# Altium schematic sheet M3_Discrete_Interface.SchDoc
size A
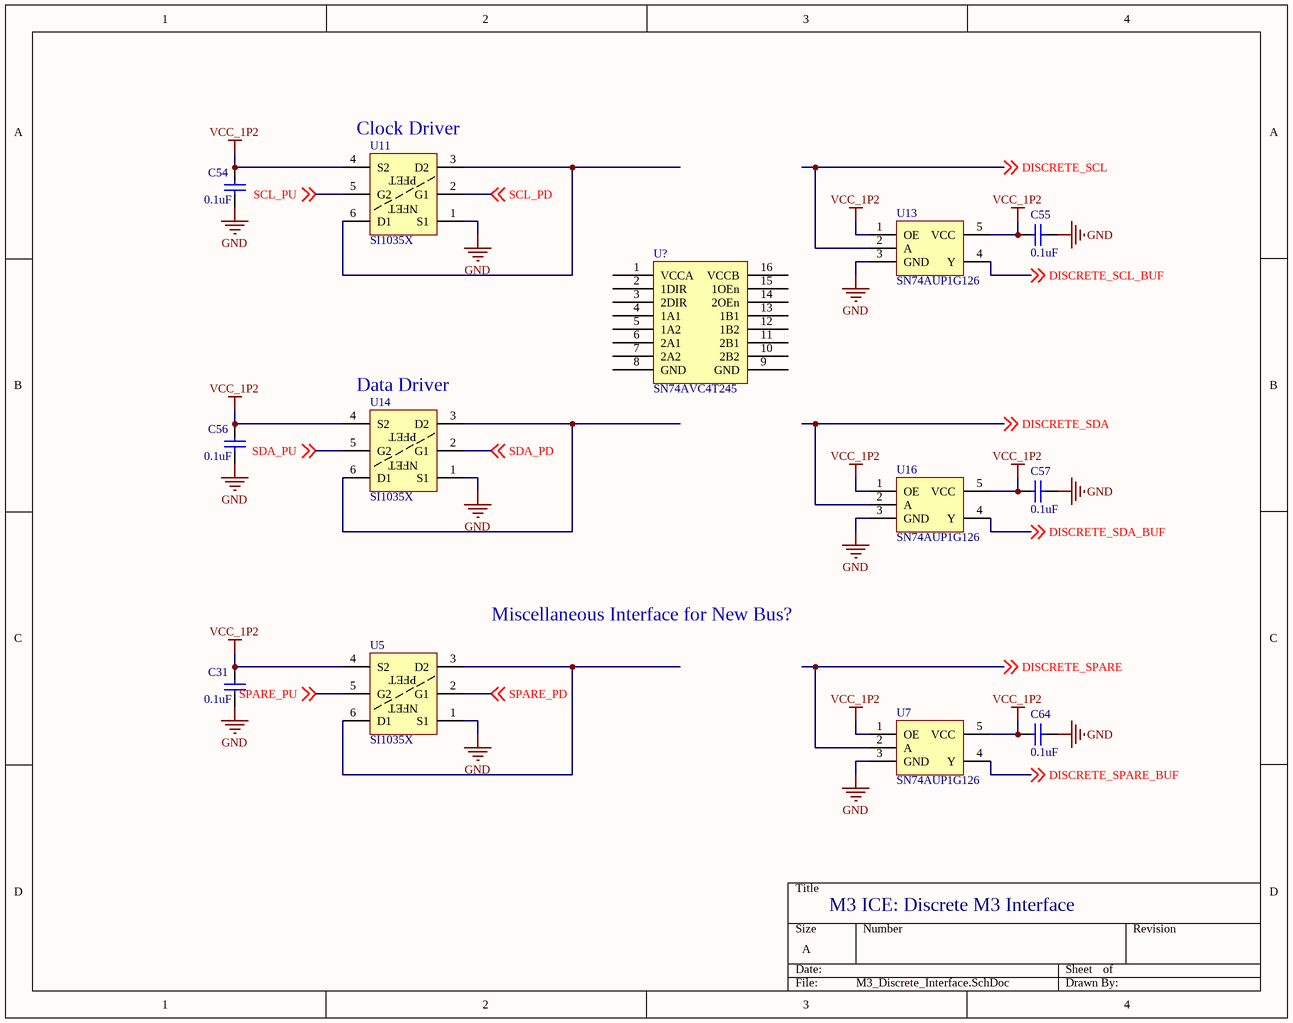
[diagram p0: M3_Discrete_Interface.SchDoc]

## Parts
C31  value 0.1uF  [1608[0603]]  (hidden comment: Cap Semi)
C54  value 0.1uF  [1608[0603]]  (hidden comment: Cap Semi)
C55  value 0.1uF  [1608[0603]]  (hidden comment: Cap Semi)
C56  value 0.1uF  [1608[0603]]  (hidden comment: Cap Semi)
C57  value 0.1uF  [1608[0603]]  (hidden comment: Cap Semi)
C64  value 0.1uF  [1608[0603]]  (hidden comment: Cap Semi)
U5  SI1035X  [SC-89-6]
U7  SN74AUP1G126  [SOT-753]
U11  SI1035X  [SC-89-6]
U13  SN74AUP1G126  [SOT-753]
U14  SI1035X  [SC-89-6]
U16  SN74AUP1G126  [SOT-753]
U?  SN74AVC4T245  [TSSOP16]

## Nets
GND: C31.1 C54.1 C55.1 C56.1 C57.1 C64.1 U5.1(S1) U7.3(GND) U11.1(S1) U13.3(GND) U14.1(S1) U16.3(GND)
VCC_1P2: C31.2 C54.2 C55.2 C56.2 C57.2 C64.2 U5.4(S2) U7.1(OE) U7.5(VCC) U11.4(S2) U13.1(OE) U13.5(VCC) U14.4(S2) U16.1(OE) U16.5(VCC)
DISCRETE_SCL: U13.2(A) ; off-sheet DISCRETE_SCL
DISCRETE_SCL_BUF: U13.4(Y) ; off-sheet DISCRETE_SCL_BUF
DISCRETE_SDA: U16.2(A) ; off-sheet DISCRETE_SDA
DISCRETE_SDA_BUF: U16.4(Y) ; off-sheet DISCRETE_SDA_BUF
DISCRETE_SPARE: U7.2(A) ; off-sheet DISCRETE_SPARE
DISCRETE_SPARE_BUF: U7.4(Y) ; off-sheet DISCRETE_SPARE_BUF
SCL_PD: U11.2(G1) ; off-sheet SCL_PD
SCL_PU: U11.5(G2) ; off-sheet SCL_PU
SDA_PD: U14.2(G1) ; off-sheet SDA_PD
SDA_PU: U14.5(G2) ; off-sheet SDA_PU
SPARE_PD: U5.2(G1) ; off-sheet SPARE_PD
SPARE_PU: U5.5(G2) ; off-sheet SPARE_PU
NetU5_3: U5.3(D2) U5.6(D1)
NetU11_3: U11.3(D2) U11.6(D1)
NetU14_3: U14.3(D2) U14.6(D1)

Not connected (* = marked no-connect by the designer): U? 1(VCCA) 2(1DIR) 3(2DIR) 4(1A1) 5(1A2) 6(2A1) 7(2A2) 8(GND) 9(GND) 10(2B2) 11(2B1) 12(1B2) 13(1B1) 14(2OEn) 15(1OEn) 16(VCCB)

## Notes on the sheet
- (near U11) Clock Driver
- (near U14) Data Driver
- Miscellaneous Interface for New Bus?
- M3 ICE: Discrete M3 Interface
- (in symbol SI1035X) PFET; NFET

## Library data of the parts
C31 C54-C57 C64 = Cap Semi: Capacitor (Semiconductor SIM Model); DistPartNo: 445-1317-1-ND; ManPartNo: C1608X7R1C104K; Published: 8-Jun-2000; LatestRevisionDate: 29-May-2009; LatestRevisionNote: IPC-7351 Footprint Added.; PackageReference: C1206; Publisher: Altium Limited; PackageDescription: Chip Capacitor
U5 U11 U14 = SI1035X: Complementary N- and P-Channel 20 V (D-S) MOSFET; DistPartNo: SI1035X-T1-GE3CT-ND; ManPartNo: SI1035X-T1-GE3
U7 U13 U16 = SN74AUP1G126: LOW-POWER SINGLE BUS BUFFER GATE WITH 3-STATE OUTPUT; DistPartNo: 296-18005-1-ND; ManPartNo: SN74AUP1G126DBVR
U? = SN74AVC4T245: DistPartNo: 568-8847-1-ND; ManPartNo: 74AVC4T245PW,118